# Altium schematic sheet SCH_Capacitive-Soil-Moisture-Sensor_2024-11-25.schdoc
size 424 x 265 mm
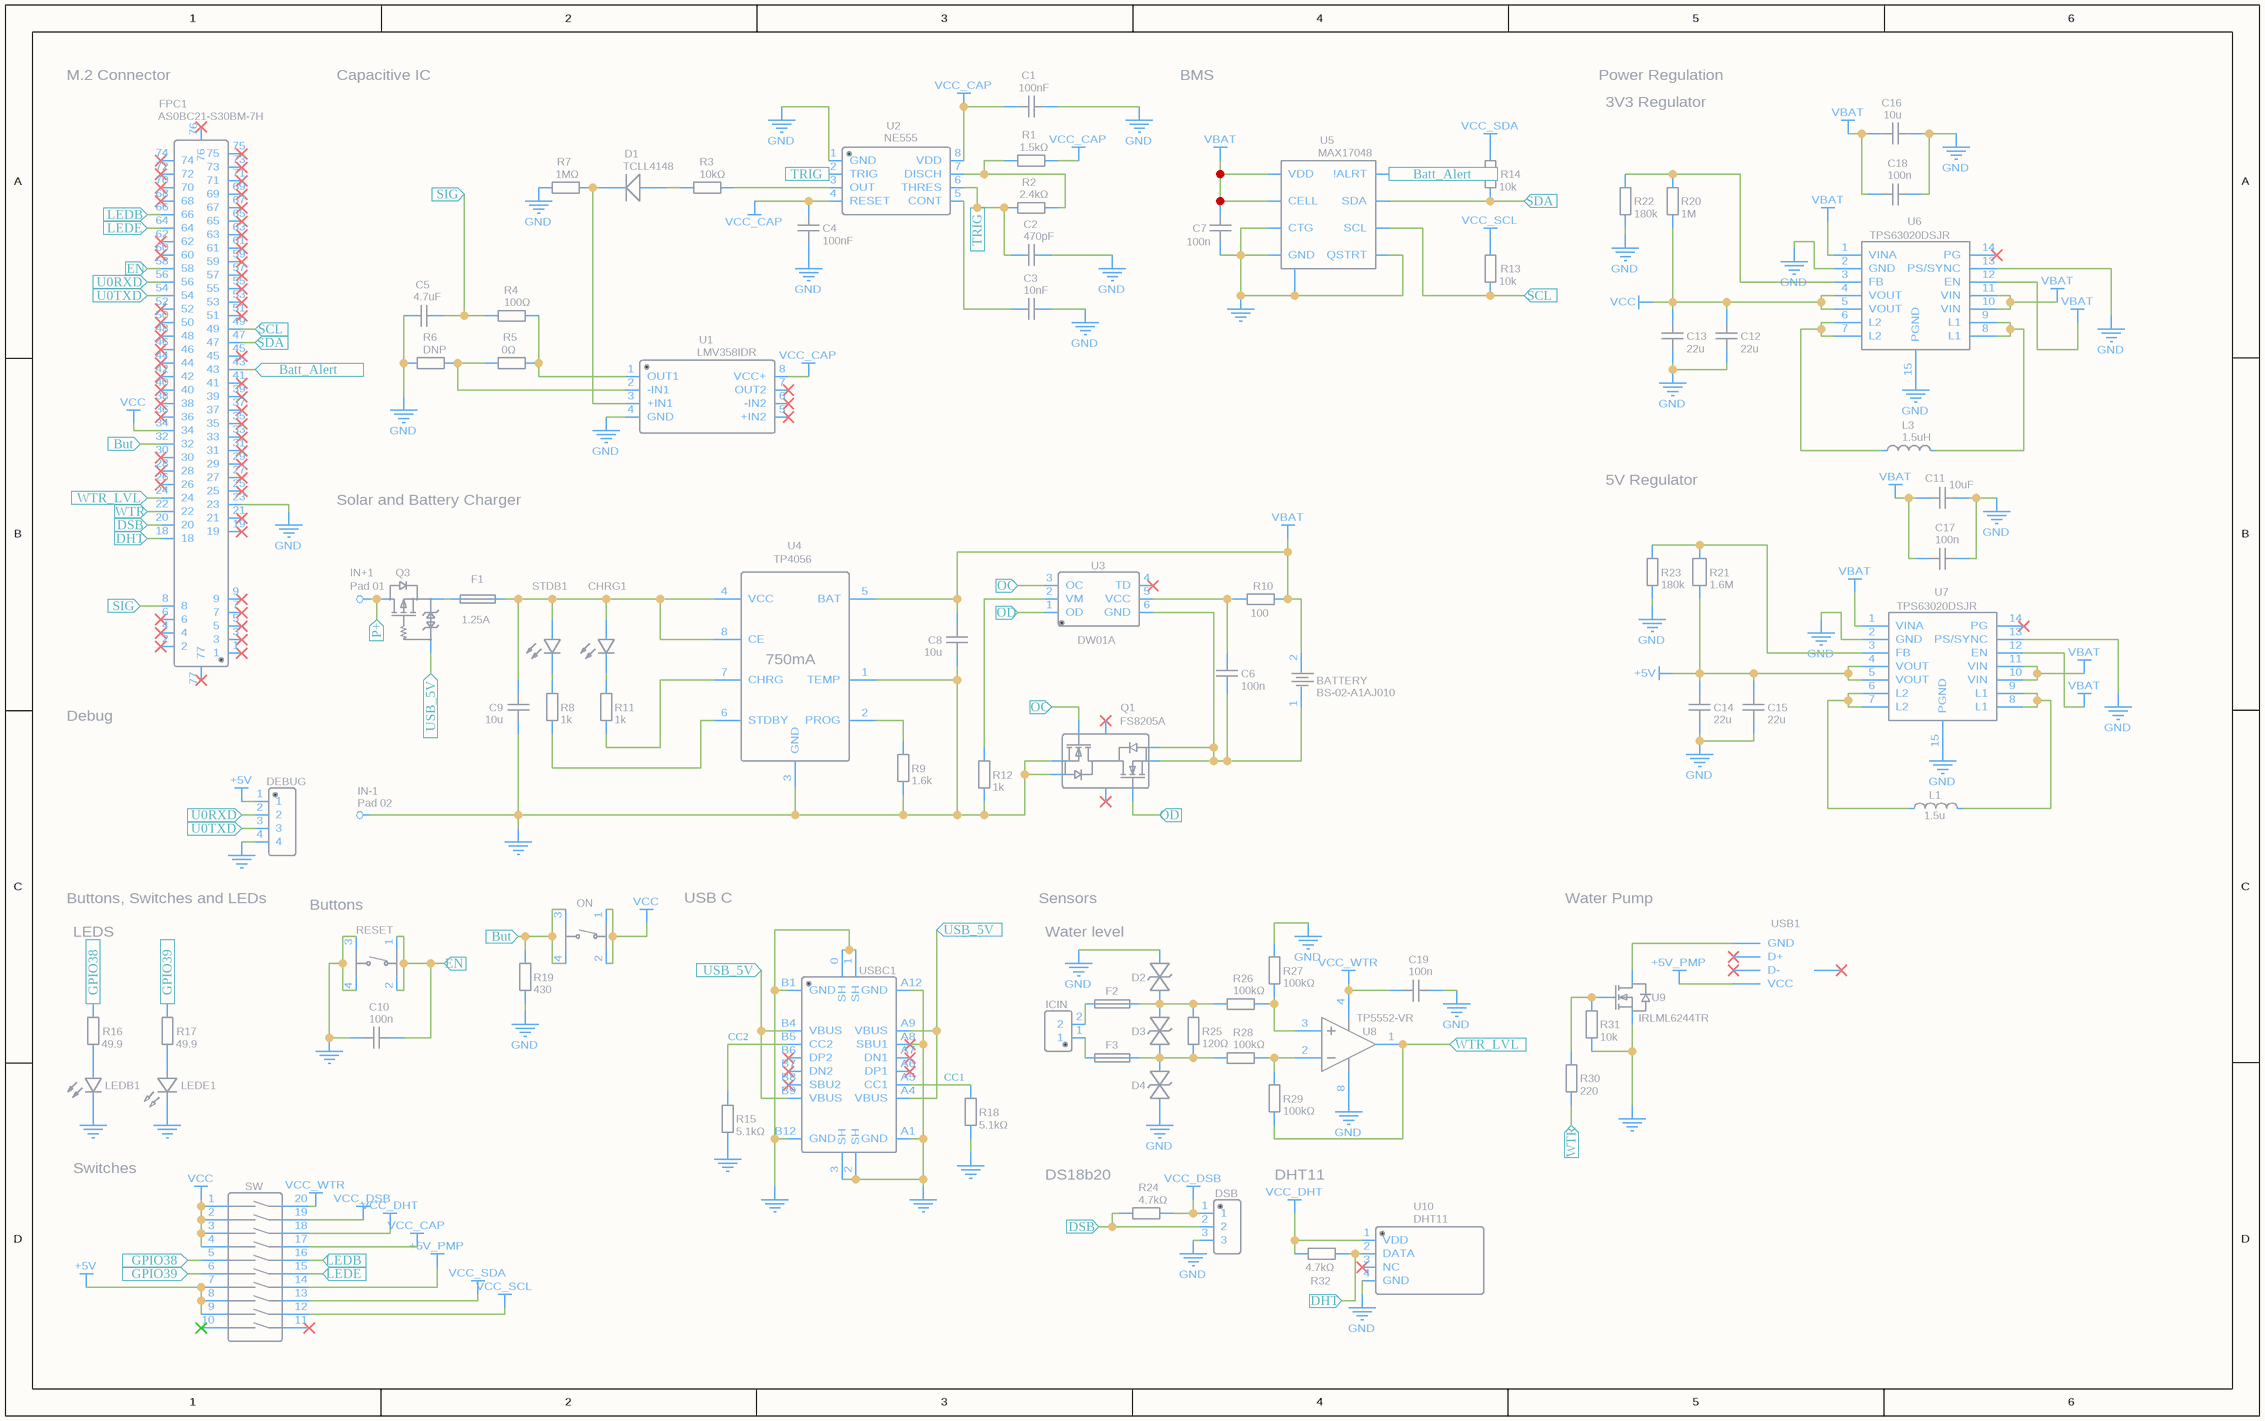
[diagram p0: SCH_Capacitive-Soil-Moisture-Sensor_2024-11-25.schdoc]

## Parts
BATTERY  BS-02-A1AJ010  [BAT-TH_BS-02-A1AJ010]
C1  100nF  [C0603]
C2  470pF  [C0603]
C3  10nF  [C0603]
C4  100nF  [C0603]
C5  4.7uF  [C0603]
C6  100n  [C0603]
C7  100n  [C0603]
C8  10u  [C0603]
C9  10u  [C0603]
C10  100n  [C0603]
C11  10uF  [C0603]
C12  22u  [C0603]
C13  22u  [C0603]
C14  22u  [C0603]
C15  22u  [C0603]
C16  10u  [C0603]
C17  100n  [C0603]
C18  100n  [C0603]
C19  100n  [C0603]
CHRG1  FC-DA1608BK-470H10  [LED0603-RD]  (value not drawn)
D1  TCLL4148  [LL-34_L3.5-W1.5-RD]
D2  SMBJ5.0CA_C726851  [SMB_L4.6-W3.6-LS5.3-BI]  (value not drawn)
D3  SMBJ5.0CA_C726851  [SMB_L4.6-W3.6-LS5.3-BI]  (value not drawn)
D4  SMBJ5.0CA_C726851  [SMB_L4.6-W3.6-LS5.3-BI]  (value not drawn)
DEBUG  2.54-1*4P母  [HDR-TH_4P-P2.54-V-F]  (value not drawn)
DSB  MX301-5.0-03P-BU01-CU-Y-A  [CONN-TH_3P-P5.0-MX301-5.0-03P-BU01-CU-Y-A]  (value not drawn)
F1  1.25A  [F0603]
F2  JK-SMD0603-001  [F0603]  (value not drawn)
F3  JK-SMD0603-001  [F0603]  (value not drawn)
FPC1  AS0BC21-S30BM-7H  [CONN-SMD_AS0BC21-S30BM-7H]
ICIN  VLT  [CONN-TH_P5.00_KF301-5.0-2P]  (value not drawn)
IN+1  Pad 01  [CON_PAD_SQUARE_32MIL]
IN-1  Pad 02  [CON_PAD_SQUARE_32MIL]
L1  1.5u  [IND-SMD_L7.2-W6.6_GPSR0730]
L3  1.5uH  [IND-SMD_L7.2-W6.6_GPSR0730]
LEDB1  FC-DA1608BK-470H10  [LED0603-RD]  (value not drawn)
LEDE1  XL-1608UGC-04  [LED0603-RD_GREEN]  (value not drawn)
ON  TS-1187A-B-A-B  [SW-SMD_4P-L5.1-W5.1-P3.70-LS6.5-TL-2]  (value not drawn)
Q1  FS8205A  [TSSOP-8_L4.4-W3.5-P0.65-LS6.4-BL]
Q3  NTA4151PT1G  [SOT-416_L1.6-W0.8-P1.00-LS1.6-BR]  (value not drawn)
R1  1.5kΩ  [R0603]
R2  2.4kΩ  [R0603]
R3  10kΩ  [R0603]
R4  100Ω  [R0603]
R5  0Ω  [R0603]
R6  DNP  [R0603]
R7  1MΩ  [R0603]
R8  1k  [R0603]
R9  1.6k  [R0603]
R10  100  [R0603]
R11  1k  [R0603]
R12  1k  [R0603]
R13  10k  [R0603]
R14  10k  [R0603]
R15  5.1kΩ  [R0603]
R16  49.9  [R0603]
R17  49.9  [R0603]
R18  5.1kΩ  [R0603]
R19  430  [R0603]
R20  1M  [R0603]
R21  1.6M  [R0603]
R22  180k  [R0603]
R23  180k  [R0603]
R24  4.7kΩ  [R0603]
R25  120Ω  [R0603]
R26  100kΩ  [R0603]
R27  100kΩ  [R0603]
R28  100kΩ  [R0603]
R29  100kΩ  [R0603]
R30  220  [R0603]
R31  10k  [R0603]
R32  4.7kΩ  [R0603]
RESET  TS-1187A-B-A-B  [SW-SMD_4P-L5.1-W5.1-P3.70-LS6.5-TL-2]  (value not drawn)
STDB1  FC-DA1608HRK-620D  [LED0603-RD_RED]  (value not drawn)
SW  DSHP10TS-S  [SW-SMD_DSHP10TS-S]  (value not drawn)
U1  LMV358IDR  [SOIC-8_L4.9-W3.9-P1.27-LS6.0-BL]
U2  NE555  [SOIC-8_L4.9-W3.9-P1.27-LS6.0-BL]
U3  DW01A  [SOT-23-6_L2.9-W1.6-P0.95-LS2.8-BL]
U4  TP4056  [ESOP-8_L4.9-W3.9-P1.27-LS6.0-BL-EP]
U5  MAX17048  [DFN-8]
U6  TPS63020DSJR  [VSON-14_L4.0-W3.0-P0.50-BL-EP_TI_DSJ]
U7  TPS63020DSJR  [VSON-14_L4.0-W3.0-P0.50-BL-EP_TI_DSJ]
U8  TP5552-VR  [SOP-8_L3.0-W3.0-P0.65-LS4.9-BL]
U9  IRLML6244TR  [SOT-23-3_L2.9-W1.3-P1.90-LS2.4-BR]
U10  DHT11  [SENSOR-TH_DHT11]
USB1  AF 180°ZJB13.7  [USB-A-TH_AF-ZJB13.7]  (value not drawn)
USBC1  TYPE-C-31-M-12  [USB-C_SMD-TYPE-C-31-M-12]  (value not drawn)

## Blocks framed on the sheet
M.2 Connector: FPC1
Capacitive IC: C1-C5 D1 R1-R7 U1 U2
BMS: C7 R13 R14 U5
5V Regulator: C11 C14 C15 C17 L1 R21 R23 U7
Debug: DEBUG
Buttons: C10 ON R19 RESET
USB C: R15 R18 USBC1
Water Pump: R30 R31 U9 USB1
Switches: SW
DS18b20: DSB R24
DHT11: R32 U10

## Ports
Batt_Alert (in), But (in), DHT (in), DSB (in), EN (in), GPIO38 (in), GPIO39 (in), LEDB (in), LEDE (in), OC (in), OD (in), P+ (in), SCL (in), SDA (in), SIG (in), TRIG (in), U0RXD (in), U0TXD (in), USB_5V (in), WTR (in), WTR_LVL (in)

## Nets
+5V: C14.2 C15.2 DEBUG.1 R21.1 SW.7 SW.8 SW.9 U7.4(VOUT) U7.5(VOUT)
+5V_PMP: SW.14 USB1.1(VCC)
GND: C1.2 C2.2 C3.2 C4.1 C5.1 C7.1 C8.1 C9.1 C10.1 C11.1 C12.1 C13.1 C14.1 C15.1 C16.2 C17.2 C18.2 C19.2 D2.2 D4.1 DEBUG.4 DSB.3 FPC1.23 IN-1.P LEDB1.1(-) LEDE1.1(K) Q1.2(S1) Q1.3(S1) R6.1 R7.1 R9.1 R12.2 R15.1 R18.1 R19.1 R22.1 R23.1 R27.1 R31.1 RESET.3(C) RESET.4(D) U1.4(GND) U2.1(GND) U4.1(TEMP) U4.3(GND) U5.P$1(CTG) U5.P$4(GND) U5.P$6(QSTRT) U5.P$9(GND) U6.2(GND) U6.13(PS/SYNC) U6.15(PGND) U7.2(GND) U7.13(PS/SYNC) U7.15(PGND) U8.8(+VS) U9.2(S) U10.4(GND) USBC1.0(SH) USBC1.1(SH) USBC1.2(SH) USBC1.3(SH) USBC1.A1(GND) USBC1.A8(SBU1) USBC1.A12(GND) USBC1.B1(GND) USBC1.B12(GND)
VBAT: BATTERY.2 C7.2 C8.2 C11.2 C16.1 C17.1 C18.1 R10.2 U4.5(BAT) U5.P$2(CELL) U5.P$3(VDD) U6.1(VINA) U6.10(VIN) U6.11(VIN) U6.12(EN) U7.1(VINA) U7.10(VIN) U7.11(VIN) U7.12(EN)
VCC: C12.2 C13.2 FPC1.34 ON.1(A) ON.2(B) R20.1 SW.1 SW.2 SW.3 SW.4 U6.4(VOUT) U6.5(VOUT)
VCC_CAP: C1.1 C4.2 R1.2 SW.17 U1.8(VCC+) U2.4(RESET) U2.8(VDD)
VCC_DHT: R32.1 SW.18 U10.1(VDD)
VCC_DSB: DSB.1 R24.2 SW.19
VCC_SCL: R13.2 SW.12
VCC_SDA: R14.2 SW.13
VCC_WTR: C19.1 SW.20 U8.4(-VS)
Batt_Alert: FPC1.43 U5.P$5(!ALRT) ; port Batt_Alert
But: FPC1.32 ON.3(C) ON.4(D) R19.2 ; port But
CC1: R18.2 USBC1.A5(CC1)
CC2: R15.2 USBC1.B5(CC2)
DHT: FPC1.18 R32.2 U10.2(DATA) ; port DHT
DSB: DSB.2 FPC1.20 R24.1 ; port DSB
EN: C10.2 FPC1.58 RESET.1(A) RESET.2(B) ; port EN
GPIO38: R16.2 SW.5 ; port GPIO38
GPIO39: R17.2 SW.6 ; port GPIO39
LEDB: FPC1.66 SW.16 ; port LEDB
LEDE: FPC1.64 SW.15 ; port LEDE
OC: Q1.4(G1) U3.3(OC) ; port OC
OD: Q1.5(G2) U3.1(OD) ; port OD
P+: IN+1.P Q3.3(D) ; port P+
SCL: FPC1.49 R13.1 U5.P$7(SCL) ; port SCL
SDA: FPC1.47 R14.1 U5.P$8(SDA) ; port SDA
SIG: C5.2 FPC1.8 R4.1 ; port SIG
TRIG: C2.1 R2.1 U2.2(TRIG) U2.6(THRES) ; port TRIG
U0RXD: DEBUG.2 FPC1.56 ; port U0RXD
U0TXD: DEBUG.3 FPC1.54 ; port U0TXD
USB_5V: Q3.1(G) USBC1.A4(VBUS) USBC1.A9(VBUS) USBC1.B4(VBUS) USBC1.B9(VBUS) ; port USB_5V
WTR: FPC1.22 R30.1 ; port WTR
WTR_LVL: FPC1.24 R29.1 U8.1(OUTA) ; port WTR_LVL
NetBATTERY_1: BATTERY.1 C6.1 Q1.6(S2) Q1.7(S2) U3.6(GND)
NetC3_1: C3.1 U2.5(CONT)
NetC6_2: C6.2 R10.1 U3.5(VCC)
NetC9_2: C9.2 CHRG1.2(+) F1.2 STDB1.2(A) U4.4(VCC) U4.8(CE)
NetCHRG1_1: CHRG1.1(-) R11.1
NetD1_1: D1.1(C) R7.2 U1.3(+IN1)
NetD1_2: D1.2(A) R3.1
NetD2_1: D2.1 D3.2 F2.2 R25.2 R26.2
NetD3_1: D3.1 D4.2 F3.2 R25.1 R28.1
NetF1_1: F1.1 Q3.2(S)
NetF2_1: F2.1 ICIN.2
NetF3_1: F3.1 ICIN.1
NetL1_1: L1.1 U7.6(L2) U7.7(L2)
NetL1_2: L1.2 U7.8(L1) U7.9(L1)
NetL3_1: L3.1 U6.6(L2) U6.7(L2)
NetL3_2: L3.2 U6.8(L1) U6.9(L1)
NetLEDB1_2: LEDB1.2(+) R16.1
NetLEDE1_2: LEDE1.2(A) R17.1
NetR1_1: R1.1 R2.2 U2.7(DISCH)
NetR3_2: R3.2 U2.3(OUT)
NetR4_2: R4.2 R5.2 U1.1(OUT1)
NetR5_1: R5.1 R6.2 U1.2(-IN1)
NetR8_1: R8.1 STDB1.1(K)
NetR8_2: R8.2 U4.6(STDBY)
NetR9_2: R9.2 U4.2(PROG)
NetR11_2: R11.2 U4.7(CHRG)
NetR12_1: R12.1 U3.2(VM)
NetR20_2: R20.2 R22.2 U6.3(FB)
NetR21_2: R21.2 R23.2 U7.3(FB)
NetR26_1: R26.1 R27.2 U8.3(+INA)
NetR28_2: R28.2 R29.2 U8.2(-INA)
NetR30_2: R30.2 R31.2 U9.1(G)
NetU9_3: U9.3(D) USB1.4(GND)

Not connected (* = marked no-connect by the designer): FPC1 1* 2* 3* 4* 5* 6* 7* 9* 19* 21* 25* 26* 27* 28* 29* 30* 31* 33* 35* 36* 37* 38* 39* 40* 41* 42* 44* 45* 46* 48* 50* 51* 52* 53* 55* 57* 59* 60* 61* 62* 63* 65* 67* 68* 69* 70* 71* 72* 73* 74* 75* 76* 77*; Q1 1(D12)* 8(D12)*; SW 10* 11*; U1 5(+IN2)* 6(-IN2)* 7(OUT2)*; U3 4(TD)*; U6 14(PG)*; U7 14(PG)*; U10 3(NC)*; USB1 2(D-)* 3(D+)* 5(SHLD)*; USBC1 A6(DP1)* A7(DN1)* B6(DP2)* B7(DN2)* B8(SBU2)*

## Notes on the sheet
- Power Regulation
- 3V3 Regulator
- Solar and Battery Charger
- (near U4) 750mA
- (near DEBUG) Buttons, Switches and LEDs
- Sensors
- LEDS
- Water level

## Library data of the parts
BATTERY = BS-02-A1AJ010: Manufacturer: MYOUNG(美阳); Contributor: lcsc; Supplier: LCSC; Supplier Part: C5239862; Manufacturer Part: BS-02-A1AJ010; JLCPCB Part Class: Extended Part; spicePre: B; spiceSymbolName: BS-02-A1AJ010
C1 C4 = 100nF: Manufacturer: YAGEO(国巨); Manufacturer Part: CC0603KRX7R9BB104; nameAlias: Value; Supplier: LCSC; Supplier Part: C14663; JLCPCB Part Class: Basic Part; spicePre: C; spiceSymbolName: CC0603KRX7R9BB104
C2 = 470pF: Manufacturer: FH(风华); Manufacturer Part: 0603B471K500NT; nameAlias: Value; Supplier: LCSC; Supplier Part: C1620; JLCPCB Part Class: Basic Part; spicePre: C; spiceSymbolName: 0603B471K500NT
C3 = 10nF: Manufacturer: YAGEO(国巨); Manufacturer Part: CC0603KRX7R9BB103; nameAlias: Value; Supplier: LCSC; Supplier Part: C100042; JLCPCB Part Class: Extended Part; spicePre: C; spiceSymbolName: CC0603KRX7R9BB103
C5 = 4.7uF: Manufacturer Part: CL10A475KP8NNNC; Manufacturer: SAMSUNG(三星); nameAlias: Value; Supplier: LCSC; Supplier Part: C1705; JLCPCB Part Class: Extended Part; spicePre: C; spiceSymbolName: CL10A475KP8NNNC
C6 = 100n: Manufacturer: FH(风华); Manufacturer Part: 0603B104K500NT; nameAlias: Value; Supplier: LCSC; Supplier Part: C30926; JLCPCB Part Class: Extended Part; link: https://lcsc.com/eda_search?q=C30926&%26type=1&ref=editor; spicePre: C; spiceSymbolName: 0603B104K500NT
C7 C10 C17-C19 = 100n: Manufacturer: YAGEO(国巨); Manufacturer Part: CC0603KRX7R9BB104; nameAlias: Capacitance; Supplier: LCSC; Supplier Part: C14663; JLCPCB Part Class: Basic Part; spicePre: C; spiceSymbolName: CC0603KRX7R9BB104
C8 C9 C16 = 10u: Manufacturer: SAMSUNG(三星); Manufacturer Part: CL10A106KP8NNNC; nameAlias: Capacitance; Supplier: LCSC; Supplier Part: C19702; JLCPCB Part Class: Basic Part; spicePre: C; spiceSymbolName: CL10A106KP8NNNC
C11 = 10uF: Manufacturer: SAMSUNG(三星); Manufacturer Part: CL10A106KP8NNNC; nameAlias: Capacitance; Supplier: LCSC; Supplier Part: C19702; JLCPCB Part Class: Basic Part; spicePre: C; spiceSymbolName: CL10A106KP8NNNC
C12-C15 = 22u: Manufacturer: SAMSUNG(三星); Manufacturer Part: CL10A226MQ8NRNC; nameAlias: Capacitance; Supplier: LCSC; Supplier Part: C59461; JLCPCB Part Class: Basic Part; spicePre: C; spiceSymbolName: CL10A226MQ8NRNC
CHRG1 LEDB1 = FC-DA1608BK-470H10: Manufacturer: 国星光电; Manufacturer Part: NCD0603B1; Supplier: LCSC; Supplier Part: C84266; JLCPCB Part Class: Extended Part; link: https://lcsc.com/eda_search?q=C84266&%26type=1&ref=editor; spicePre: L; spiceSymbolName: FC-DA1608BK-470H10
D1 = TCLL4148: Manufacturer: TC(德昌); Contributor: LCSC; Supplier: LCSC; Manufacturer Part: TCLL4148; Supplier Part: C127077; JLCPCB Part Class: Extended Part; spicePre: D; spiceSymbolName: TCLL4148
D2-D4 = SMBJ5.0CA_C726851: Manufacturer: TWGMC(台湾迪嘉); Contributor: LCSC; Supplier: LCSC; Supplier Part: C726851; Manufacturer Part: SMBJ5.0CA; JLCPCB Part Class: Extended Part; spicePre: D; spiceSymbolName: SMBJ5.0CA_C726851
DEBUG = 2.54-1*4P母: Manufacturer: BOOMELE(博穆精密); Contributor: LCSC; Supplier: LCSC; Supplier Part: C2718488; Manufacturer Part: 2.54-1*4P母; JLCPCB Part Class: Extended Part; spicePre: H; spiceSymbolName: 2.54-1*4P母
DSB = MX301-5.0-03P-BU01-CU-Y-A: Manufacturer: MAX(迈旭); Contributor: lcsc; Supplier: LCSC; Supplier Part: C5188423; Manufacturer Part: MX301-5.0-03P-BU01-Cu-Y-A; JLCPCB Part Class: Extended Part; spicePre: C; spiceSymbolName: MX301-5.0-03P-BU01-CU-Y-A
F1 = 1.25A: Manufacturer: 大毅科技; Manufacturer Part: CF06V3T1R25; Contributor: LCSC; Supplier: LCSC; Supplier Part: C163109; JLCPCB Part Class: Extended Part; spicePre: F; spiceSymbolName: CF06V3T1R25
F2 F3 = JK-SMD0603-001: Manufacturer: JK(金科); Contributor: LCSC; Supplier: LCSC; Supplier Part: C2687114; Manufacturer Part: JK-SMD0603-001; JLCPCB Part Class: Extended Part; spicePre: F; spiceSymbolName: JK-SMD0603-001
FPC1 = AS0BC21-S30BM-7H: Manufacturer: FOXCONN(富士康); Contributor: LCSC; Supplier: LCSC; Supplier Part: C2832351; Manufacturer Part: AS0BC21-S30BM-7H; JLCPCB Part Class: Extended Part; link: https://lcsc.com/eda_search?q=C2832351&%26type=1&ref=editor; spicePre: F; spiceSymbolName: AS0BC21-S30BM-7H
ICIN = VLT: Manufacturer: Cixi Kefa Elec; Manufacturer Part: KF301-5.0-2P; Contributor: VasilyN; Package Display: No; Supplier: LCSC; Supplier Part: C474881; spicePre: U; spiceSymbolName: KF301-5.0-2P
IN+1 = Pad 01: Contributor: DangerousPrototype; Manufacturer Part: ?; spicePre: T
IN-1 = Pad 02: Contributor: DangerousPrototype; Manufacturer Part: ?; spicePre: T
L1 = 1.5u: Manufacturer: SHOU HAN(首韩); Manufacturer Part: CYA0630-1.5UH; nameAlias: Value; Contributor: lcsc; Supplier: LCSC; Supplier Part: C5189745; JLCPCB Part Class: Extended Part; spicePre: L; spiceSymbolName: CYA0630-1.5UH
L3 = 1.5uH: Manufacturer: SHOU HAN(首韩); Manufacturer Part: CYA0630-1.5UH; nameAlias: Value; Contributor: lcsc; Supplier: LCSC; Supplier Part: C5189745; JLCPCB Part Class: Extended Part; spicePre: L; spiceSymbolName: CYA0630-1.5UH
LEDE1 = XL-1608UGC-04: Manufacturer: XINGLIGHT(成兴光); Contributor: lcsc; Supplier: LCSC; Supplier Part: C965804; Manufacturer Part: XL-1608UGC-04; JLCPCB Part Class: Extended Part; link: https://lcsc.com/eda_search?q=C965804&%26type=1&ref=editor; spicePre: L; spiceSymbolName: XL-1608UGC-04
ON RESET = TS-1187A-B-A-B: Manufacturer: XKB Connectivity(中国星坤); Contributor: LCSC; Supplier: LCSC; Supplier Part: C318884; Manufacturer Part: TS-1187A-B-A-B; JLCPCB Part Class: Basic Part; spicePre: S; spiceSymbolName: TS-1187A-B-A-B
Q1 = FS8205A: Manufacturer: FORTUNE; Supplier: LCSC; Manufacturer Part: FS8205A; LCSC Assembly: Yes; image: //image.lceda.cn/szlcsc/C16052.jpg; spicePre: Q; Supplier Part: C16052; JLCPCB Part Class: Extended Part
Q3 = NTA4151PT1G: Manufacturer: onsemi(安森美); Supplier: LCSC; Manufacturer Part: NTA4151PT1G; Supplier Part: C54876; JLCPCB Part Class: Extended Part; spicePre: Q; spiceSymbolName: NTA4151PT1G
R1 = 1.5kΩ: Manufacturer: UNI-ROYAL(厚声); Manufacturer Part: 0603WAF1501T5E; nameAlias: Value; Supplier: LCSC; Supplier Part: C22843; JLCPCB Part Class: Basic Part; spicePre: R; spiceSymbolName: 0603WAF1501T5E
R2 = 2.4kΩ: Manufacturer: UNI-ROYAL(厚声); Manufacturer Part: 0603WAF2401T5E; nameAlias: Value; Supplier: LCSC; Supplier Part: C22940; JLCPCB Part Class: Basic Part; spicePre: R; spiceSymbolName: 0603WAF2401T5E
R3 = 10kΩ: Manufacturer: UNI-ROYAL(厚声); Manufacturer Part: 0603WAF1002T5E; nameAlias: Value; Supplier: LCSC; Supplier Part: C25804; JLCPCB Part Class: Basic Part; spicePre: R; spiceSymbolName: 0603WAF1002T5E
R4 = 100Ω: Manufacturer: YAGEO(国巨); Manufacturer Part: RC0603FR-07100RL; nameAlias: Value; Supplier: LCSC; Supplier Part: C105588; JLCPCB Part Class: Extended Part; spicePre: R; spiceSymbolName: RC0603FR-07100RL
R5 = 0Ω: Manufacturer: UNI-ROYAL(厚声); Manufacturer Part: 0603WAF0000T5E; nameAlias: Value; Supplier: LCSC; Supplier Part: C21189; JLCPCB Part Class: Basic Part; spicePre: R; spiceSymbolName: 0603WAF0000T5E
R6 = DNP: Manufacturer: YAGEO(国巨); Manufacturer Part: RC0603FR-07100RL; nameAlias: Value; Supplier: LCSC; Supplier Part: DNP; JLCPCB Part Class: Extended Part; spicePre: R; spiceSymbolName: RC0603FR-07100RL
R7 = 1MΩ: Manufacturer: UNI-ROYAL(厚声); Manufacturer Part: 0603WAF1004T5E; nameAlias: Value; Supplier: LCSC; Supplier Part: C22935; JLCPCB Part Class: Basic Part; spicePre: R; spiceSymbolName: 0603WAF1004T5E
R8 R11 R12 = 1k: Manufacturer: UNI-ROYAL(厚声); Manufacturer Part: 0603WAF1001T5E; nameAlias: Value; Supplier: LCSC; Supplier Part: C21190; JLCPCB Part Class: Basic Part; link: https://lcsc.com/eda_search?q=C21190&%26type=1&ref=editor; spicePre: R; spiceSymbolName: 0603WAF1001T5E
R9 = 1.6k: Manufacturer: UniOhm; Manufacturer Part: 0603WAJ0162T5E; nameAlias: Resistance (Ohms); Supplier: LCSC; Supplier Part: C25990; JLCPCB Part Class: Extended Part; spicePre: R; spiceSymbolName: 0603WAJ0162T5E
R10 = 100: Manufacturer: UNI-ROYAL(厚声); Manufacturer Part: 0603WAF1000T5E; nameAlias: Resistance; Supplier: LCSC; Supplier Part: C22775; Resistance (Ohms): 100; JLCPCB Part Class: Basic Part; spicePre: R; spiceSymbolName: 0603WAF1000T5E
R13 R14 R31 = 10k: Manufacturer: UNI-ROYAL(厚声); Manufacturer Part: 0603WAF1002T5E; nameAlias: Value; Supplier: LCSC; Supplier Part: C25804; JLCPCB Part Class: Basic Part; spicePre: R; spiceSymbolName: 0603WAF1002T5E
  R13 R14: link: https://lcsc.com/eda_search?q=C25804&%26type=1&ref=editor
R15 R18 = 5.1kΩ: Manufacturer Part: 0603WAF5101T5E; Manufacturer: UNI-ROYAL(厚声); Resistance (Ohms): 5.1K; nameAlias: Resistance; Supplier: LCSC; Supplier Part: C23186; JLCPCB Part Class: Basic Part; spicePre: R; spiceSymbolName: 0603WAF5101T5E
R16 R17 = 49.9: Manufacturer: UNI-ROYAL(厚声); Manufacturer Part: 0603WAF499JT5E; nameAlias: Value; Supplier: LCSC; Supplier Part: C23185; JLCPCB Part Class: Basic Part; link: https://lcsc.com/eda_search?q=C23185&%26type=1&ref=editor; spicePre: R; spiceSymbolName: 0603WAF499JT5E
R19 = 430: Manufacturer: UNI-ROYAL(厚声); Manufacturer Part: 0603WAF4300T5E; nameAlias: Value; Supplier: LCSC; Supplier Part: C23170; JLCPCB Part Class: Basic Part; link: https://lcsc.com/eda_search?q=C23170&%26type=1&ref=editor; spicePre: R; spiceSymbolName: 0603WAF4300T5E
R20 = 1M: Manufacturer: UNI-ROYAL(厚声); Manufacturer Part: 0603WAF1004T5E; nameAlias: Value; Supplier: LCSC; Supplier Part: C22935; JLCPCB Part Class: Basic Part; spicePre: R; spiceSymbolName: 0603WAF1004T5E
R21 = 1.6M: Manufacturer: FOJAN(富捷); Manufacturer Part: FRC0603J165 TS; nameAlias: Value; Contributor: lcsc; Supplier: LCSC; Supplier Part: C2933272; JLCPCB Part Class: Extended Part; spicePre: R; spiceSymbolName: FRC0603J165 TS
R22 R23 = 180k: Manufacturer: RALEC(旺诠); Manufacturer Part: RTT03184JTP; nameAlias: Value; Supplier: LCSC; Supplier Part: C103362; JLCPCB Part Class: Extended Part; spicePre: R; spiceSymbolName: RTT03184JTP
R24 R32 = 4.7kΩ: Manufacturer: YAGEO(国巨); Manufacturer Part: RC0603FR-074K7L; nameAlias: Value; Supplier: LCSC; Supplier Part: C99782; JLCPCB Part Class: Extended Part; spicePre: R; spiceSymbolName: RC0603FR-074K7L
R25 = 120Ω: Manufacturer: UNI-ROYAL(厚声); Manufacturer Part: 0603WAF1200T5E; nameAlias: Value; Supplier: LCSC; Supplier Part: C22787; JLCPCB Part Class: Basic Part; spicePre: R; spiceSymbolName: 0603WAF1200T5E
R26-R29 = 100kΩ: Manufacturer: UNI-ROYAL(厚声); Manufacturer Part: 0603WAF1003T5E; nameAlias: Value; Supplier: LCSC; Supplier Part: C25803; JLCPCB Part Class: Basic Part; spicePre: R; spiceSymbolName: 0603WAF1003T5E
R30 = 220: Manufacturer: UNI-ROYAL(厚声); Manufacturer Part: 0603WAF2200T5E; nameAlias: Value; Supplier: LCSC; Supplier Part: C22962; JLCPCB Part Class: Basic Part; spicePre: R; spiceSymbolName: 0603WAF2200T5E
STDB1 = FC-DA1608HRK-620D: Manufacturer: 国星光电; Manufacturer Part: NCD0603R1; Supplier: LCSC; Supplier Part: C84263; JLCPCB Part Class: Extended Part; link: https://lcsc.com/eda_search?q=C84263&%26type=1&ref=editor; spicePre: L; spiceSymbolName: FC-DA1608HRK-620D
SW = DSHP10TS-S: Manufacturer: XKB Connectivity(中国星坤); Contributor: LCSC; Supplier: LCSC; Supplier Part: C319046; Manufacturer Part: DSHP10TS-S; JLCPCB Part Class: Extended Part; spicePre: S; spiceSymbolName: DSHP10TS-S
U1 = LMV358IDR: Manufacturer: TI(德州仪器); Supplier: LCSC; Manufacturer Part: LMV358IDR; Supplier Part: C63813; JLCPCB Part Class: Extended Part; spicePre: U; spiceSymbolName: LMV358IDR
U2 = NE555: Manufacturer: TI(德州仪器); Manufacturer Part: TLC555IDR; nameAlias: Value; spicePre: X; Supplier: LCSC; Supplier Part: C6987; JLCPCB Part Class: Extended Part; spiceSymbolName: TLC555IDR
U3 = DW01A: Manufacturer: PUOLOP(迪浦); Contributor: LCSC; Supplier: LCSC; Supplier Part: C351410; Manufacturer Part: DW01A; JLCPCB Part Class: Extended Part; spicePre: U; spiceSymbolName: DW01A_C351410
U4 = TP4056: Manufacturer: TOPPOWER(南京拓微); Manufacturer Part: TP4056-42-ESOP8; Contributor: Guest; Supplier: LCSC; LCSC Assembly: Yes; image: //image.lceda.cn/szlcsc/C16581.jpg; spicePre: U; Supplier Part: C16581; JLCPCB Part Class: Basic Part
U5 = MAX17048: description: Micropower 1-Cell Li+ ModelGauge; timeStamp: 1468591666; spicePre: U; spiceSymbolName: MAX17048; Supplier Part: C2682616
U6 U7 = TPS63020DSJR: Manufacturer: TI(德州仪器); Supplier: LCSC; Manufacturer Part: TPS63020DSJR; Supplier Part: C15483; JLCPCB Part Class: Extended Part; link: https://lcsc.com/eda_search?q=C15483&%26type=1&ref=editor; spicePre: U; spiceSymbolName: TPS63020DSJR
U8 = TP5552-VR: subpart_no: 1; Manufacturer: 3PEAK; Supplier: LCSC; Supplier Part: C248604; Manufacturer Part: TP5552-VR; JLCPCB Part Class: Extended Part; spicePre: U; spiceSymbolName: TP5552-VR
U9 = IRLML6244TR: Manufacturer: UMW(广东友台半导体); Manufacturer Part: IRLML6244TR(UMW); Contributor: lcsc; Supplier: LCSC; Supplier Part: C5354986; spicePre: U; spiceSymbolName: IRLML6244TR(UMW)
U10 = DHT11: Manufacturer: 广州奥松; Contributor: LCSC; Supplier: LCSC; Supplier Part: C117051; Manufacturer Part: DHT11; JLCPCB Part Class: Extended Part; spicePre: U; spiceSymbolName: DHT11
USB1 = AF 180°ZJB13.7: Manufacturer: SHOU HAN(首韩); Contributor: LCSC; Supplier: LCSC; Supplier Part: C456015; Manufacturer Part: AF 180°ZJB13.7; JLCPCB Part Class: Extended Part; spicePre: U; spiceSymbolName: AF 180°ZJB13.7
USBC1 = TYPE-C-31-M-12: Manufacturer: 韩国韩荣; Contributor: LCSC; Supplier: LCSC; Supplier Part: C165948; Manufacturer Part: TYPE-C-31-M-12; JLCPCB Part Class: Extended Part; spicePre: U; spiceSymbolName: TYPE-C-31-M-12